# Altium schematic sheet MAX10.SchDoc
size B
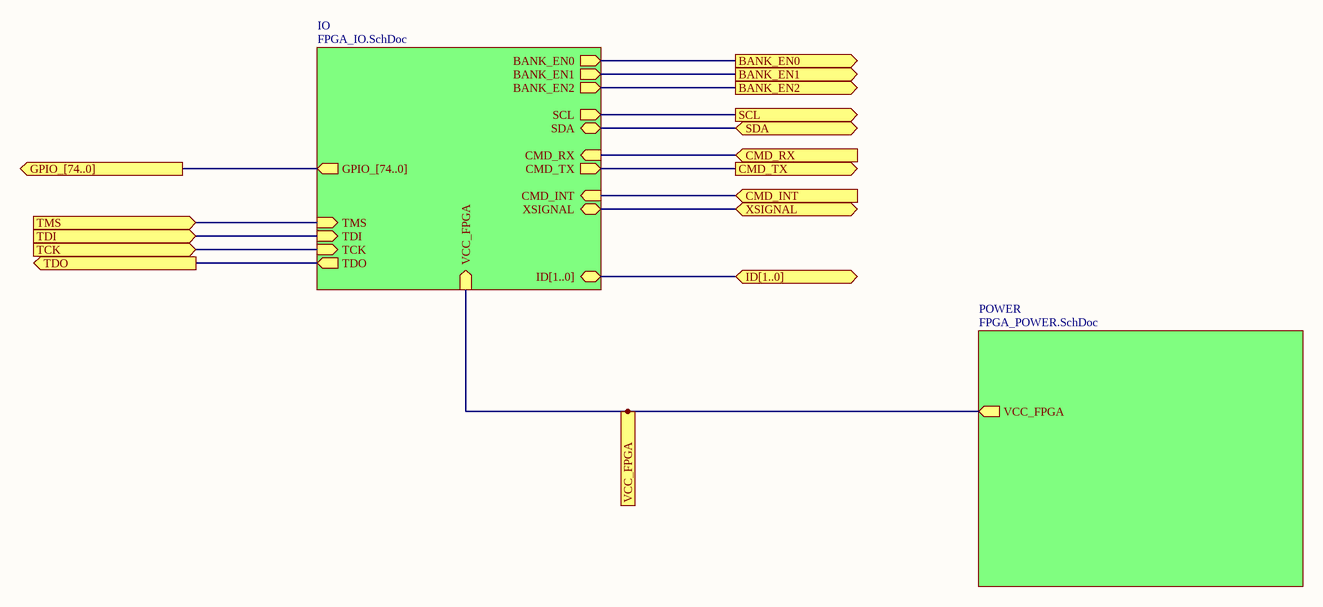
[diagram p0: MAX10.SchDoc]

## Sub-sheets
IO = FPGA_IO.SchDoc: CMD_RX (in), CMD_TX (out), BANK_EN1 (out), BANK_EN0 (out), SDA (bidir), CMD_INT (in), BANK_EN2 (out), SCL (out), GPIO_[74..0] (out), XSIGNAL (bidir), ID[1..0] (bidir), TMS (in), TDI (in), TCK (in), TDO (out), VCC_FPGA (in)
POWER = FPGA_POWER.SchDoc: VCC_FPGA (out)

## Ports
BANK_EN0 (out), BANK_EN1 (out), BANK_EN2 (out), CMD_INT (in), CMD_RX (in), CMD_TX (out), GPIO_[74..0] (out), ID[1..0] (bidir), SCL (out), SDA (bidir), TCK (in), TDI (in), TDO (out), TMS (in), VCC_FPGA (out), XSIGNAL (bidir)

## Nets
BANK_EN0: port BANK_EN0, sheet IO/BANK_EN0
BANK_EN1: port BANK_EN1, sheet IO/BANK_EN1
BANK_EN2: port BANK_EN2, sheet IO/BANK_EN2
CMD_INT: port CMD_INT, sheet IO/CMD_INT
CMD_RX: port CMD_RX, sheet IO/CMD_RX
CMD_TX: port CMD_TX, sheet IO/CMD_TX
SCL: port SCL, sheet IO/SCL
SDA: port SDA, sheet IO/SDA
TCK: port TCK, sheet IO/TCK
TDI: port TDI, sheet IO/TDI
TDO: port TDO, sheet IO/TDO
TMS: port TMS, sheet IO/TMS
VCC_FPGA: port VCC_FPGA, sheet IO/VCC_FPGA, sheet POWER/VCC_FPGA
XSIGNAL: port XSIGNAL, sheet IO/XSIGNAL

## Buses and harness runs
bus port GPIO_[74..0] = sheet IO/GPIO_[74..0]
bus port ID[1..0] = sheet IO/ID[1..0]